# EAGLE schematic untitled (EAGLE 9.0.1)
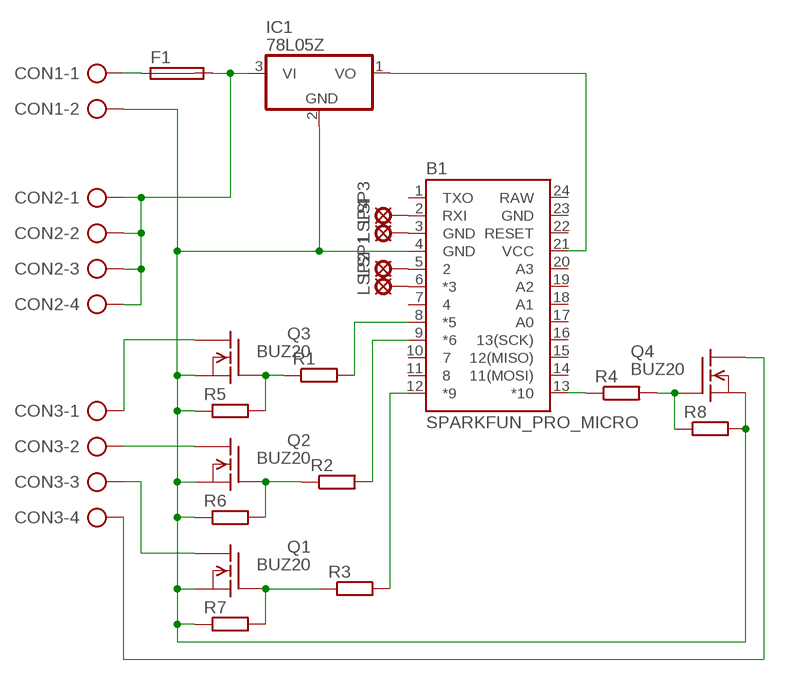
[diagram p0: schematic, sheet 1]

## Parts
B1  SPARKFUN_PRO_MICRO  [SPARKFUN_PRO_MICRO]
CON1  AK500/2  [AK500/2]
CON2  AK500/4  [AK500/4]
CON3  AK500/4  [AK500/4]
F1  SH25  [SH25]
IC1  78L05Z  [TO92]
LSP1  LSP10  [LSP10]
LSP2  LSP10  [LSP10]
LSP3  LSP10  [LSP10]
LSP4  LSP10  [LSP10]
Q1  BUZ20  [TO220]
Q2  BUZ20  [TO220]
Q3  BUZ20  [TO220]
Q4  BUZ20  [TO220]
R1  R-EU_0207/10  [0207/10]
R2  R-EU_0207/10  [0207/10]
R3  R-EU_0207/10  [0207/10]
R4  R-EU_0207/10  [0207/10]
R5  R-EU_0207/10  [0207/10]
R6  R-EU_0207/10  [0207/10]
R7  R-EU_0207/10  [0207/10]
R8  R-EU_0207/10  [0207/10]

## Nets
N$1: B1.21(VCC) IC1.1(VO)
N$2: CON1.1 F1.1
N$3: B1.8(*5) R1.2
N$4: B1.9(*6) R2.2
N$5: B1.12(*9) R3.2
N$6: B1.4(GND) CON1.2 IC1.2(GND) Q1.3(S) Q2.3(S) Q3.3(S) Q4.3(S) R5.1 R6.1 R7.1 R8.2
N$7: CON2.1 CON2.2 CON2.3 CON2.4 F1.2 IC1.3(VI)
N$8: B1.13(*10) R4.1
N$9: CON3.2 Q2.2(D)
N$10: CON3.3 Q1.2(D)
N$11: Q4.1(G) R4.2 R8.1
N$12: CON3.4 Q4.2(D)
N$13: CON3.1 Q3.2(D)
N$14: Q3.1(G) R1.1 R5.2
N$15: Q2.1(G) R2.1 R6.2
N$16: Q1.1(G) R3.1 R7.2
N$17: B1.5 LSP1.MP
N$18: B1.6(*3) LSP2.MP
N$19: B1.2(RXI) LSP3.MP
N$20: B1.3(GND) LSP4.MP
Unconnected: B1.1(TXO) B1.7 B1.10 B1.11 B1.14(11(MOSI)) B1.15(12(MISO)) B1.16(13(SCK)) B1.17(A0) B1.18(A1) B1.19(A2) B1.20(A3) B1.22(RESET)

## Power pins joined to a net without a drawn wire
GND: B1.23(GND)
RAW: B1.24(RAW)

## Library data of the parts
B1 = SparkFun-Boards:SPARKFUN_PRO_MICRO: SparkFun Pro Micro Atmega32U4 compatible footprint. SparkFun Products: 3.3V/8MHz <https://www.sparkfun.com/products/12587> 5V/16MHz <https://www.sparkfun.com/products/12640>
CON1 = #Svorkovnice:AK500/2: CONNECTOR
CON2 CON3 = #Svorkovnice:AK500/4: CONNECTOR
F1 = fuse:SH25: FUSE HOLDER grid 25 mm, OGN0031 8211, Schurter (Buerklin); MF: SCHURTER; MPN: 0031.8211; OC_FARNELL: 1162741; OC_NEWARK: 96B9380
IC1 = linear:78*: Positive VOLTAGE REGULATOR Source: http://cache.national.com/ds/LM/LM78L05.pdf http://www.fairchildsemi.com/ds/LM/LM7805.pdf
LSP1-LSP4 = solpad:LSP10: SOLDER PAD drill 1.0 mm, distributor Buerklin, 12H555
Q1-Q4 = transistor-fet:BUZ20: N-Channel Enhancement MOSFET 100V; 12A; 0,2Ohm
R1-R8 = rcl:R-EU_: RESISTOR, European symbol; SPICEPREFIX: R